# EAGLE schematic stm32_breakout (EAGLE 8.5.2)
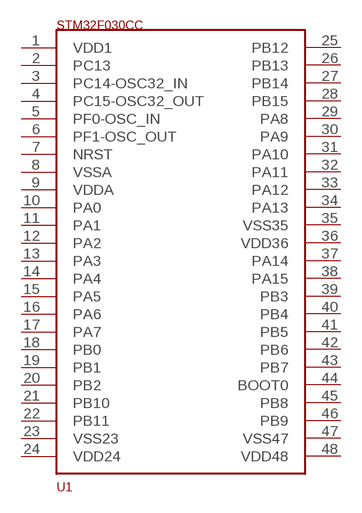
[diagram p0: schematic, sheet 1]

## Parts
U1  STM32F030CC  [STM32F030CC]
Unconnected: U1.1(VDD1) U1.2(PC13) U1.3(PC14-OSC32_IN) U1.4(PC15-OSC32_OUT) U1.5(PF0-OSC_IN) U1.6(PF1-OSC_OUT) U1.7(NRST) U1.8(VSSA) U1.9(VDDA) U1.10(PA0) U1.11(PA1) U1.12(PA2) U1.13(PA3) U1.14(PA4) U1.15(PA5) U1.16(PA6) U1.17(PA7) U1.18(PB0) U1.19(PB1) U1.20(PB2) U1.21(PB10) U1.22(PB11) U1.23(VSS23) U1.24(VDD24) U1.25(PB12) U1.26(PB13) U1.27(PB14) U1.28(PB15) U1.29(PA8) U1.30(PA9) U1.31(PA10) U1.32(PA11) U1.33(PA12) U1.34(PA13) U1.35(VSS35) U1.36(VDD36) U1.37(PA14) U1.38(PA15) U1.39(PB3) U1.40(PB4) U1.41(PB5) U1.42(PB6) U1.43(PB7) U1.44(BOOT0) U1.45(PB8) U1.46(PB9) U1.47(VSS47) U1.48(VDD48)

## Library data of the parts
U1 = lights:STM32F030CC